# EAGLE design minimal_receiver (EAGLE 9.4.2)
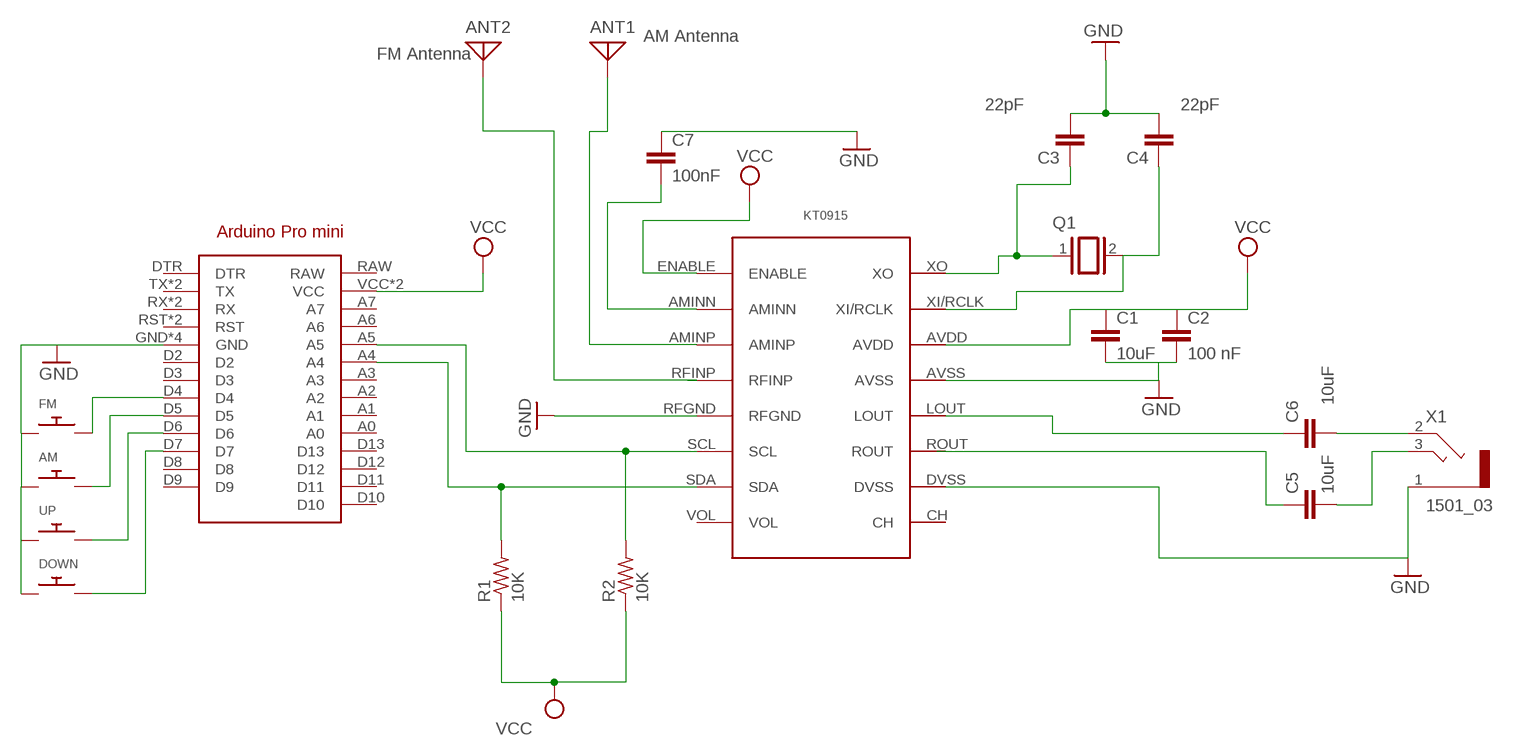
[diagram p0: schematic, sheet 1]

## Parts
AM  SWITCH_PUSHBUTTONEVQ-PE  [TACT_PANA-EVQ]
ANT1  AM Antenna  ANTENNA  [PAD-01]
ANT2  FM Antenna  ANTENNA  [PAD-01]
ARDUINO1  ARDUINO_PRO_MINI  [ARDUINO_PRO_MINI]
C1  10uF  10UF-0603-6.3V-20%  [0603]
C2  100 nF  C-EUC1825K  [C1825K]
C3  22pF  C-EUC1825K  [C1825K]
C4  22pF  C-EUC1825K  [C1825K]
C5  10uF  C-EUC1825K  [C1825K]
C6  10uF  C-EUC1825K  [C1825K]
C7  100nF  C-EUC1825K  [C1825K]
DOWN  SWITCH_PUSHBUTTONEVQ-PE  [TACT_PANA-EVQ]
FM  SWITCH_PUSHBUTTONEVQ-PE  [TACT_PANA-EVQ]
KT0915  KT0915  [KT0915]
Q1  XTAL  [Q]
R1  10K  FLIPFLOP-RES  [0805-THM]
R2  10K  FLIPFLOP-RES  [0805-THM]
UP  SWITCH_PUSHBUTTONEVQ-PE  [TACT_PANA-EVQ]
X1  1501_03  [1501_03]

## Nets
GND: AM.P$1 ARDUINO1.GND ARDUINO1.GND@1(GND) ARDUINO1.GND@2(GND) ARDUINO1.GND@3(GND) C1.2 C2.2 C3.2 C4.2 C7.1 DOWN.P$1 FM.P$1 KT0915.AVSS KT0915.DVSS KT0915.RFGND UP.P$1 X1.1
N$1: ARDUINO1.D4 FM.P$2
N$2: ARDUINO1.A4 KT0915.SDA R1.2
N$3: ARDUINO1.A5 KT0915.SCL R2.2
N$4: C4.1 KT0915.XI/RCLK Q1.2
N$5: C3.1 KT0915.XO Q1.1
N$6: C6.1 KT0915.LOUT
N$7: C6.2 X1.2
N$8: C5.2 X1.3
N$9: C7.2 KT0915.AMINN
N$10: AM.P$2 ARDUINO1.D5
N$11: ANT1.1 KT0915.AMINP
N$12: ANT2.1 KT0915.RFINP
N$13: ARDUINO1.D6 UP.P$2
N$14: ARDUINO1.D7 DOWN.P$2
N$26: C5.1 KT0915.ROUT
VCC: ARDUINO1.VCC ARDUINO1.VCC@1(VCC) C1.1 C2.1 KT0915.AVDD KT0915.ENABLE R1.1 R2.1
Unconnected: ARDUINO1.A0 ARDUINO1.A1 ARDUINO1.A2 ARDUINO1.A3 ARDUINO1.A6 ARDUINO1.A7 ARDUINO1.D2 ARDUINO1.D3 ARDUINO1.D8 ARDUINO1.D9 ARDUINO1.D10 ARDUINO1.D11 ARDUINO1.D12 ARDUINO1.D13 ARDUINO1.DTR ARDUINO1.RAW ARDUINO1.RST ARDUINO1.RST@1(RST) ARDUINO1.RX ARDUINO1.RX@1(RX) ARDUINO1.TX ARDUINO1.TX@1(TX) KT0915.CH KT0915.VOL

## Library data of the parts
AM DOWN FM UP = adafruit:SWITCH_PUSHBUTTON: Buttons SOFTTOUCHSMD_SJ - Soft touch temporary push button (Super Junk Akihabara) Compatible with SKPMANE010 [Mouser: 688-SKPMAN] C&K_KSS = Digikey: KSS221GLFS
ANT1 ANT2 = discrete:ANTENNA: Antenna
ARDUINO1 = arduinopromini:ARDUINO_PRO_MINI: For creating Arduino Pro Mini shields
C1 = SparkFun-Capacitors:10UF: 10.0µF ceramic capacitors A capacitor is a passive two-terminal electrical component used to store electrical energy temporarily in an electric field.; PROD_ID: CAP-11015
C2-C7 = rcl:C-EU: CAPACITOR, European symbol; SPICEPREFIX: C
KT0915 = dp_devices:KT0915
Q1 = special:XTAL: CRYSTAL
R1 R2 = adafruit:FLIPFLOP-RES: Flip Flop resistor An 0805 resistor inside a standard 1/4W 5% resistor. Makes for easy mods
X1 = con-lumberg:1501_03: Klinkensteckverbinder nach JISC 6560, 2,5 mm Jack connectors according to JISC 6560, 2.5 mm Source: http://www.lumberg.com/Produkte/PDFs/1501_03.pdf; OC_FARNELL: 1200127; OC_NEWARK: unknown

## Board
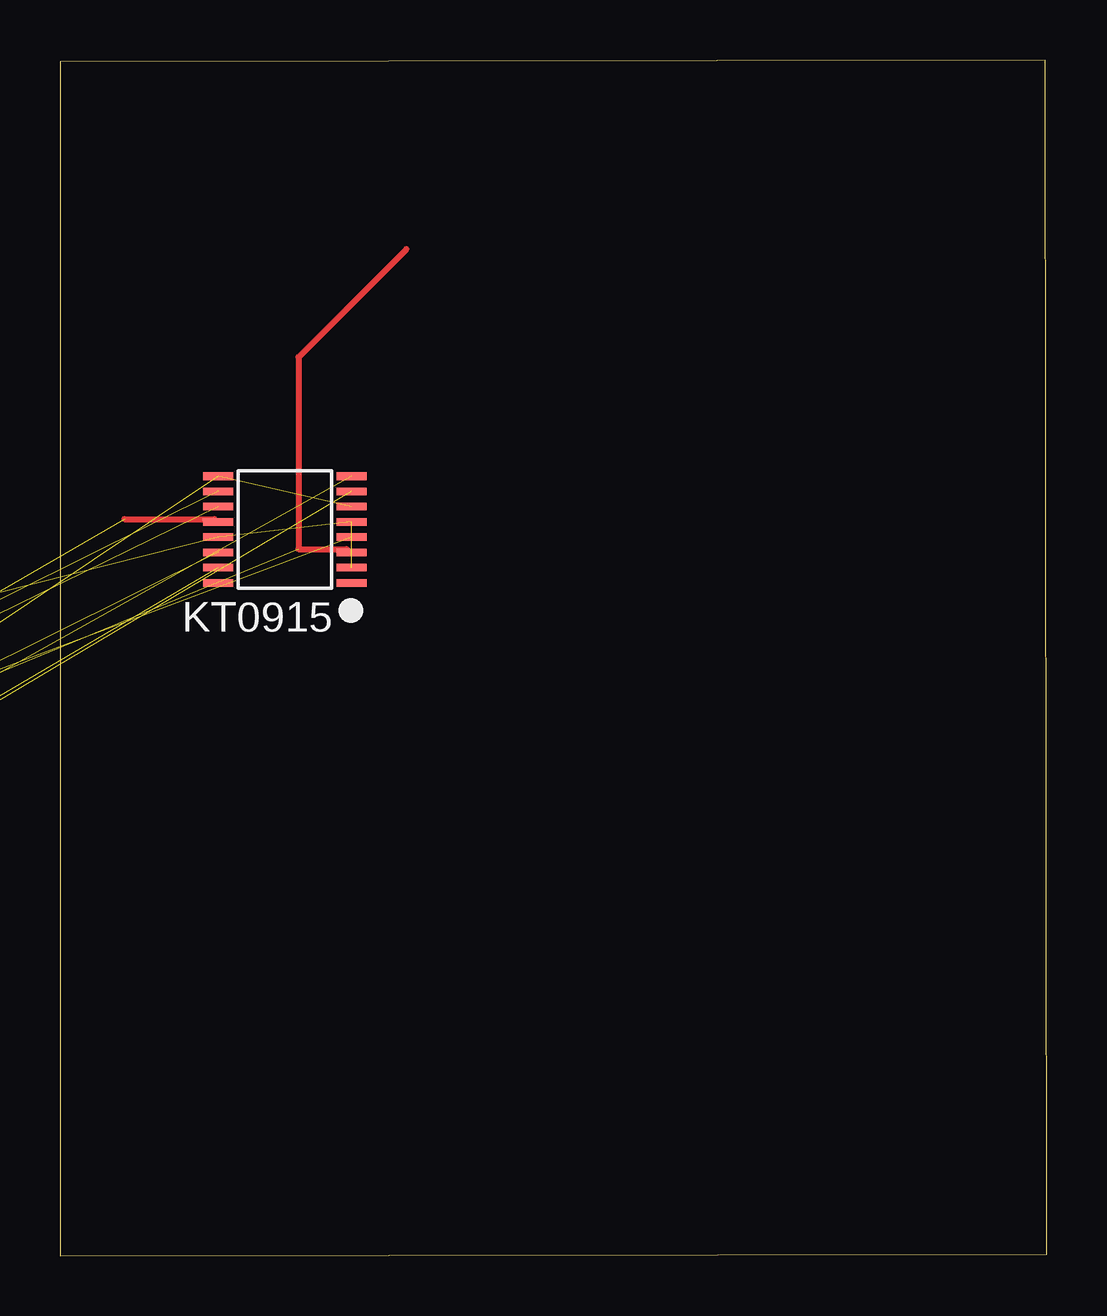
[diagram p1: board, top side]

Size 41.12 x 49.81 mm. Coordinates in mm from the lower left corner, seen from the top.
Outline: 0,0 41.13,0.06 41.06,49.81 0,49.75 0,0
Copper layers (1*16): Top 0.035mm / dielectric 1.6mm / Bottom 0.035mm
Design rules "Elecrow_2-layer_PCB_eagle_rule": minimum track width 6mil, minimum drill 12mil, track to track 6mil, track to pad 6mil, pad to pad 6mil, via to via 8mil, smd to smd 0mil, copper to edge 20mil, drill to drill 10mil, minimum pad ring 6mil, minimum via ring 6mil, stop-mask expansion 0mil, vias tented up to drill 100mil, thermal gap 10mil

### Footprints (pad centres in the part's own frame; a part is rotated, then mirrored left to right if it is on the bottom)
TACT_PANA-EVQ = drill 1.3 pad 2.54: P$1 -3.25,0; P$2 3.25,0
PAD-01 = drill 1.321 pad 2.54 octagon: 1 0,0
ARDUINO_PRO_MINI = drill 1: A0 11.43,-8.89; A1 11.43,-6.35; A2 11.43,-3.81; A3 11.43,-1.27; A4 8.89,-2.54; A5 8.89,0; A6 6.35,-19.05; A7 8.89,-19.05; BLK 10.16,11.43; D2 -3.81,-1.27; D3 -3.81,-3.81; D4 -3.81,-6.35; D5 -3.81,-8.89; D6 -3.81,-11.43; D7 -3.81,-13.97; D8 -3.81,-16.51; D9 -3.81,-19.05; D10 11.43,-19.05; D11 11.43,-16.51; D12 11.43,-13.97; D13 11.43,-11.43; DTR -2.54,11.43; GND -3.81,1.27; GND@1 11.43,6.35; GND@2 7.62,11.43; GND@3 3.81,-19.05; RAW 11.43,8.89; RST 11.43,3.81; RST@1 -3.81,3.81; RX -3.81,6.35; RX@1 2.54,11.43; TX -3.81,8.89; TX@1 0,11.43; VCC 11.43,1.27; VCC@1 5.08,11.43
0603 = smd 1.1 x 1: 1 -0.85,0; 2 0.85,0
C1825K = smd 1.8 x 6.9: 1 -1.5,0; 2 1.5,0
KT0915 = smd 0.32 x 1.26: AMINN 1.587,2.779; AMINP 0.952,2.779; AVDD 0.952,-2.779; AVSS 0.317,-2.779; CH -2.223,-2.779; DVSS -1.588,-2.779; ENABLE 2.222,2.779; LOUT -0.318,-2.779; RFGND -0.318,2.779; RFINP 0.317,2.779; ROUT -0.953,-2.779; SCL -0.953,2.779; SDA -1.588,2.779; VOL -2.223,2.779; XI/RCLK 1.587,-2.779; XO 2.222,-2.779
Q = drill 0.61 long: 1 -2.54,-7.62; 2 2.54,-7.62
0805-THM = drill 0.813 pad 1.676 octagon: 1 -5.08,0; 2 5.08,0
1501_03 = drill 1.1 pad 1.7: 1 -1.85,0.3; 2 1.85,-1; 3 -1.85,-5.7 | hole 1.1: 0,0; 0,-6

### Placement (x,y rotation side)
AM  -85.81,-59.75 0 top  (outside the outline)
ANT1  -81.81,-12 0 top  (outside the outline)
ANT2  -81.81,-18.19 0 top  (outside the outline)
ARDUINO1  -23.19,18.94 0 top  (outside the outline)
C1  -26.44,-5.5 0 top  (outside the outline)
C2  -32.62,-1.94 0 top  (outside the outline)
C3  -87.94,-24.5 0 top  (outside the outline)
C4  -87.94,-34.69 0 top  (outside the outline)
C5  -64.56,-1.94 0 top  (outside the outline)
C6  -71.25,-1.94 0 top  (outside the outline)
C7  -87.94,-14.31 0 top  (outside the outline)
DOWN  -85.81,-70.38 0 top  (outside the outline)
FM  -85.81,-54.44 0 top  (outside the outline)
KT0915  9.38,30.25 90 top
Q1  -54.38,1.5 0 top  (outside the outline)
R1  -84.38,-43.19 0 top  (outside the outline)
R2  -84.38,-47.81 0 top  (outside the outline)
UP  -85.81,-65.06 0 top  (outside the outline)
X1  -78.62,0 0 top  (outside the outline)

### Tracks (layer width: path | path; a pad name or v marks a point on that pad's centre or on a via)
GND  (16 unrouted)
N$1  (1 unrouted)
N$2  (2 unrouted)
N$3  (2 unrouted)
N$4  (2 unrouted)
N$5  (2 unrouted)
N$6  (1 unrouted)
N$7  (1 unrouted)
N$8  (1 unrouted)
N$9  (1 unrouted)
N$10  (1 unrouted)
N$11  (1 unrouted)
N$12  (1 unrouted)
  Top 0.254: 2.69,30.69 6.44,30.69 KT0915.RFINP
N$13  (1 unrouted)
N$14  (1 unrouted)
N$26  (1 unrouted)
  Top 0.254: 14.44,41.94 9.94,37.44 9.94,29.44 11.94,29.44 KT0915.ROUT
VCC  (7 unrouted)